# Altium schematic sheet Power.SchDoc: {Наименование}
size 420 x 297 mm; ApprovedBy: {Утвердил}; CheckedBy: {Проверил}; DrawnBy: {Разработал}; Engineer: {Инженер}; DocumentNumber: {Обозначение}; SheetNumber: {}; SheetTotal: {}; Scale: {Масш.}; Title1str: {Наименование}; PageSetup: Record=PageOptions|CenterHorizontal=False|CenterVertical=False|PrintScale=0.95|XCorrection=0.00|YCorrection=0.00|PrintKind=1|BorderSize=5000000|LeftOffset=0|BottomOffset=0|Orientation=1|PaperLength=1000|PaperWidth=1000|Scale=100|PaperSource=15|PrintQuality=600|MediaType=1|DitherType=10|PaperKind=A4|PrintScaleMode=1; Title2str: {Наименование}; ProcessInspection: {Т.контр.}; Mass: {Масса}; NormInspection: {Н.контр.}; EngineerName: {Инженер}; Letter1Column: {}; Letter2Column: {}; Letter3Column: {}; DocumentType: {Документ}; DocumentType1str: {Документ}; DocumentType2str: {Документ}; ImagePath: {Перв. применение}; Rule: PcbType=ProtelPcb
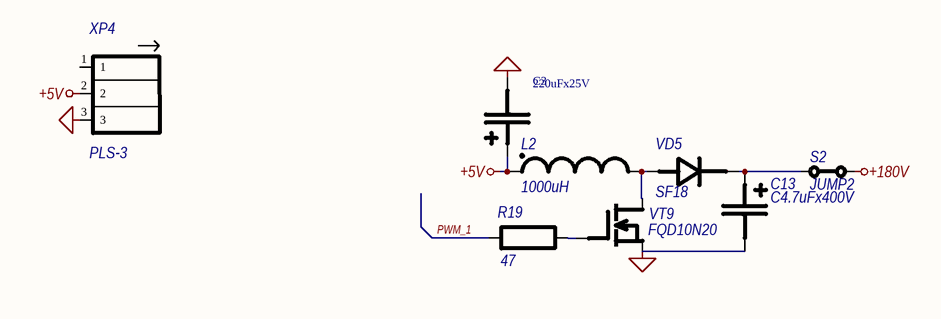
[diagram p0: Power.SchDoc]

## Parts
C3  220uFx25V  [C8x11.5]
C13  C4.7uFx400V  [C10x16]
L2  1000uH  [CHOKE1]
R19  47  [CR2012-0805]
S2  JUMP2  [JUMP]
VD5  SF18  [DO-41]
VT9  FQD10N20  [TO-252]
XP4  PLS-3  [PLS-3]

## Nets
+5V: C3.1 L2.1 XP4.2
+180V: S2.1
SGND: C3.2 C13.2 VT9.2(S) XP4.3
PWM_1: R19.1
NetC13_1: C13.1 S2.2 VD5.2(K)
NetL2_2: L2.2 VD5.1(A) VT9.3(D)
NetR19_2: R19.2 VT9.1(G)

Not connected (* = marked no-connect by the designer): XP4 1

## Notes on the sheet
- Перв. примен.
- Справ. №
- Подп. и дата
- Инв. № дубл.
- Взам. инв. №
- Изм.
- Лист
- № докум.
- Подп.
- Дата
- Лит.
- Масса
- Масштаб
- Т.контр.
- Пров.
- Разраб.
- Листов
- Инв. № подл.
- Н.контр.
- Утв.
- Копировал
- Формат А3

## Library data of the parts
C3 = C220uFx25V YAGEO SY: SY025M0220A3F-0811
L2 = CHOKE_1
R19 = R0805-47R-5%